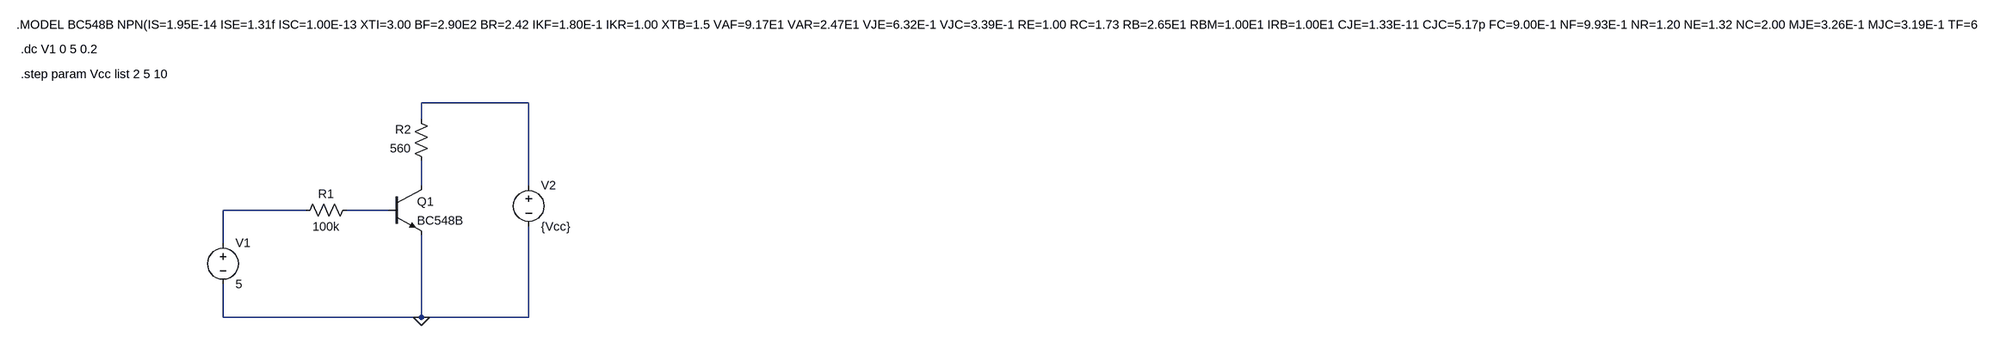
[diagram p0: schematic transf_corriente.asc]
transf_corriente.asc, the LTspice schematic file:
Version 4.1
SHEET 1 4788 680
WIRE 560 -144 352 -144
WIRE 352 -112 352 -144
WIRE 352 16 352 -32
WIRE 560 16 560 -144
WIRE 128 64 -32 64
WIRE 288 64 208 64
WIRE -32 128 -32 64
WIRE -32 272 -32 208
WIRE 352 272 352 112
WIRE 352 272 -32 272
WIRE 560 272 560 96
WIRE 560 272 352 272
FLAG 352 272 0
SYMBOL voltage -32 112 R0
SYMATTR InstName V1
SYMATTR Value 5
SYMBOL res 224 48 R90
WINDOW 0 0 56 VBottom 2
WINDOW 3 32 56 VTop 2
SYMATTR InstName R1
SYMATTR Value 100k
SYMBOL res 368 -16 R180
WINDOW 0 36 76 Left 2
WINDOW 3 36 40 Left 2
SYMATTR InstName R2
SYMATTR Value 560
SYMBOL voltage 560 0 R0
SYMATTR InstName V2
SYMATTR Value {Vcc}
SYMBOL npn 288 16 R0
SYMATTR InstName Q1
SYMATTR Value BC548B
TEXT -432 -296 Left 2 !.MODEL BC548B NPN(IS=1.95E-14 ISE=1.31f ISC=1.00E-13 XTI=3.00 BF=2.90E2 BR=2.42 IKF=1.80E-1 IKR=1.00 XTB=1.5 VAF=9.17E1 VAR=2.47E1 VJE=6.32E-1 VJC=3.39E-1 RE=1.00 RC=1.73 RB=2.65E1 RBM=1.00E1 IRB=1.00E1 CJE=1.33E-11 CJC=5.17p FC=9.00E-1 NF=9.93E-1 NR=1.20 NE=1.32 NC=2.00 MJE=3.26E-1 MJC=3.19E-1 TF=6.52E-10 TR=0 ITF=1.03 VTF=1.65 XTF=1.00E2 EG=1.11 VCEO=30 ICRATING=100m MFG=PHILIPS)
TEXT -424 -248 Left 2 !.dc V1 0 5 0.2
TEXT -424 -200 Left 2 !.step param Vcc list 2 5 10

The netlist it stands for:
* transf_corriente.asc
V1 N003 0 5
R1 N004 N003 100k
R2 N002 N001 560
V2 N001 0 {Vcc}
Q1 N002 N004 0 0 BC548B
.model NPN NPN
.model PNP PNP
.lib standard.bjt
.MODEL BC548B NPN(IS=1.95E-14 ISE=1.31f ISC=1.00E-13 XTI=3.00 BF=2.90E2 BR=2.42 IKF=1.80E-1 IKR=1.00 XTB=1.5 VAF=9.17E1 VAR=2.47E1 VJE=6.32E-1 VJC=3.39E-1 RE=1.00 RC=1.73 RB=2.65E1 RBM=1.00E1 IRB=1.00E1 CJE=1.33E-11 CJC=5.17p FC=9.00E-1 NF=9.93E-1 NR=1.20 NE=1.32 NC=2.00 MJE=3.26E-1 MJC=3.19E-1 TF=6.52E-10 TR=0 ITF=1.03 VTF=1.65 XTF=1.00E2 EG=1.11 VCEO=30 ICRATING=100m MFG=PHILIPS)
.dc V1 0 5 0.2
.step param Vcc list 2 5 10
.backanno
.end